# EAGLE design Final try I hope (EAGLE 9.6.2)
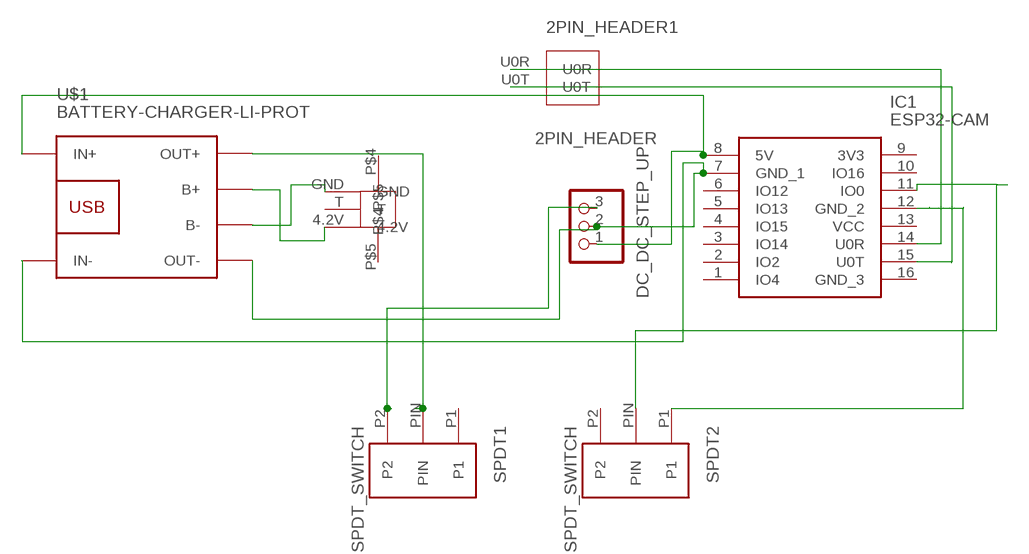
[diagram p0: schematic, sheet 1]

## Parts
2PIN_HEADER1  2PIN_HEADER  [2PIN_HEADER]
DC_DC_STEP_UP  PINHD-1X3  [1X03]
IC1  ESP32-CAM  [ESP32CAM]
SPDT1  SPDT_SWITCH  [SPDT_SWITCH]
SPDT2  SPDT_SWITCH  [SPDT_SWITCH]
U$1  BATTERY-CHARGER-LI-PROT  [BATTERY-CHARGER-LI-PROT]
U$2  BATTERY_CONNECTOR  [BATTERY_CONNECTOR]

## Nets
N$1: DC_DC_STEP_UP.1 IC1.8(5V) U$1.IN+
N$2: DC_DC_STEP_UP.3 SPDT1.P2
N$3: U$1.B- U$2.GND
N$4: U$1.B+ U$2.4.2V
N$5: IC1.11(IO0) SPDT2.PIN
N$6: IC1.12(GND_2) SPDT2.P1
N$8: 2PIN_HEADER1.U0R IC1.14(U0R)
N$9: 2PIN_HEADER1.U0T IC1.15(U0T)
N$11: SPDT1.PIN U$1.OUT+
N$12: DC_DC_STEP_UP.2 IC1.7(GND_1) U$1.IN- U$1.OUT-
Unconnected: IC1.1(IO4) IC1.2(IO2) IC1.3(IO14) IC1.4(IO15) IC1.5(IO13) IC1.6(IO12) IC1.9(3V3) IC1.10(IO16) IC1.13(VCC) IC1.16(GND_3) SPDT1.P1 SPDT2.P2 U$2.P$4 U$2.P$5 U$2.T

## Library data of the parts
2PIN_HEADER1 = 2pin_HEADER:2PIN_HEADER
DC_DC_STEP_UP = pinhead:PINHD-1X3: PIN HEADER
IC1 = ESP32-CAM:ESP32-CAM: Modules PCBA Module RoHS Source: Datasheet <https://datasheet.lcsc.com/szlcsc/Ai-Thinker-ESP32-CAM_C277946.pdf>; DESCRIPTION: Modules PCBA Module RoHS; HEIGHT: 5mm; MANUFACTURER_NAME: Ai-Thinker; MANUFACTURER_PART_NUMBER: ESP32-CAM
SPDT1 SPDT2 = SPDT_SWITCH:SPDT_SWITCH
U$1 = diy-modules:BATTERY-CHARGER-LI-PROT: Lithium Battery 5V Charger with protection circuit More details available here: http://www.instructables.com/id/DIY-Lithium-ion-Battery-Charger/step4/TP4056-based-lithium-ion-battery-charger-module/ Click here to find device on ebay.com <http://www.ebay.com/sch/tp4056+charger+usb+protection>
U$2 = Fuck:BATTERY_CONNECTOR

## Board
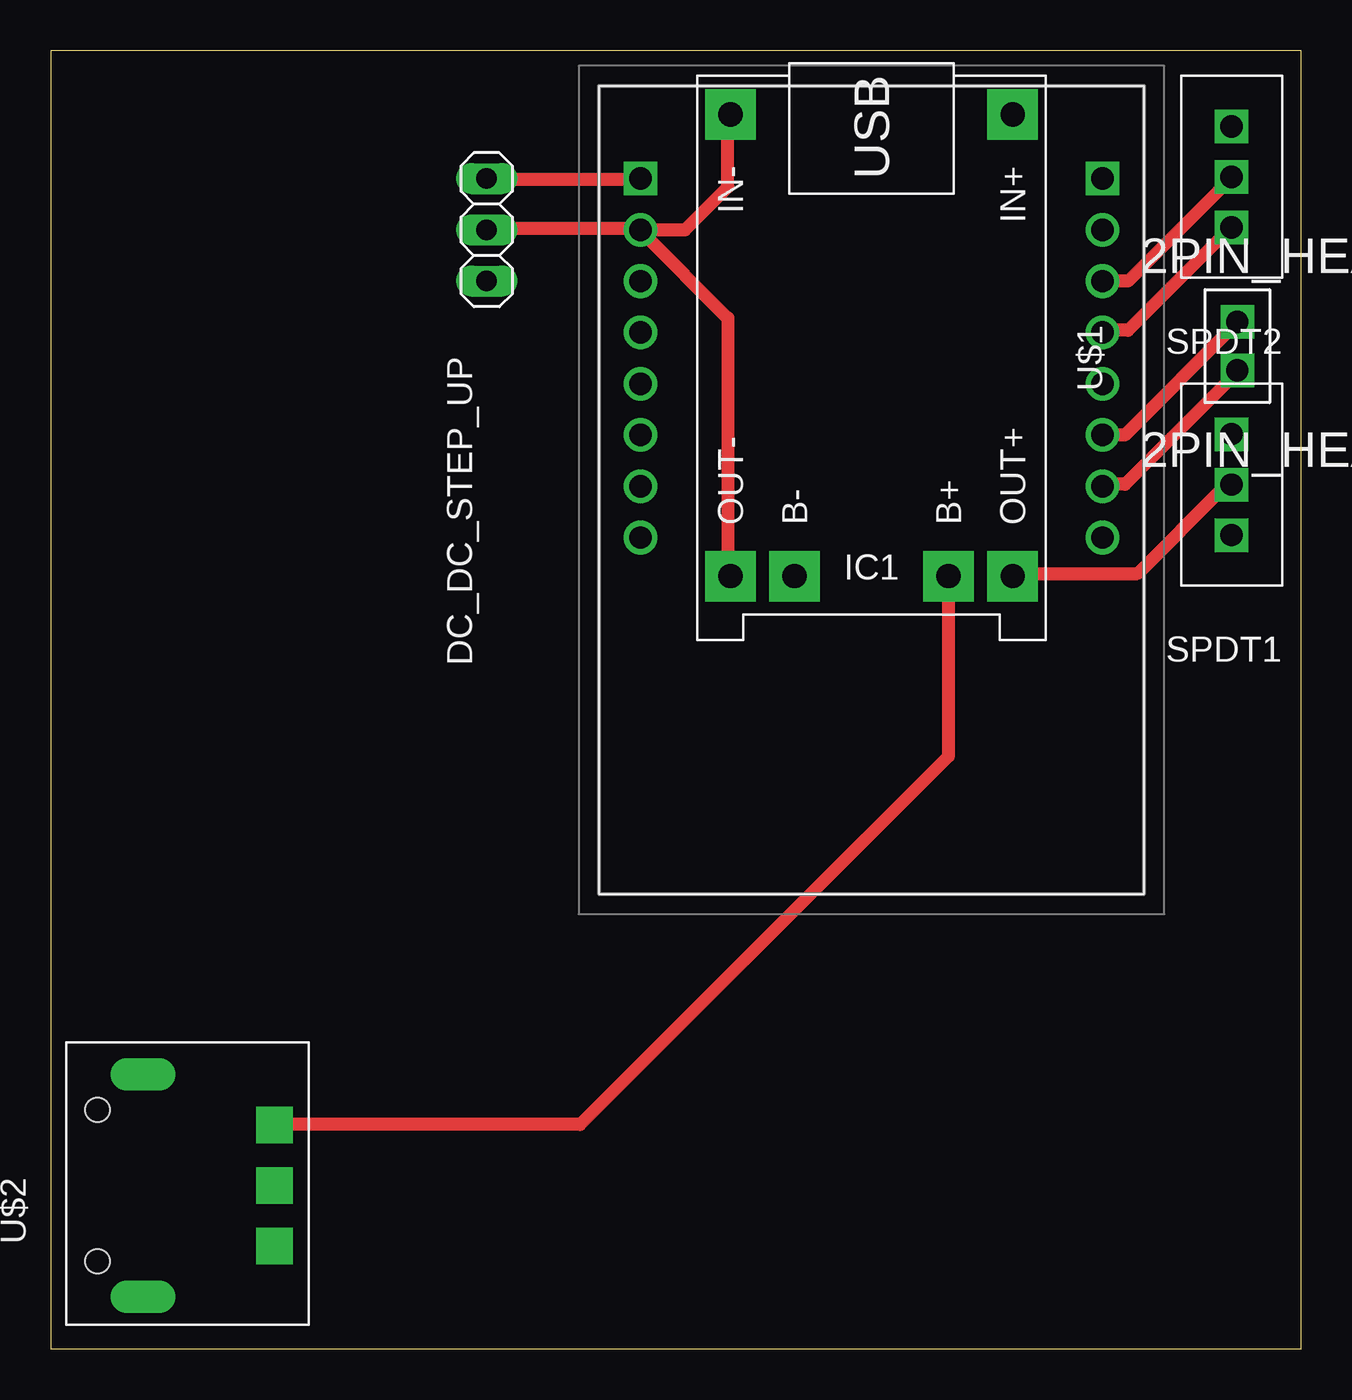
[diagram p1: board, top side]
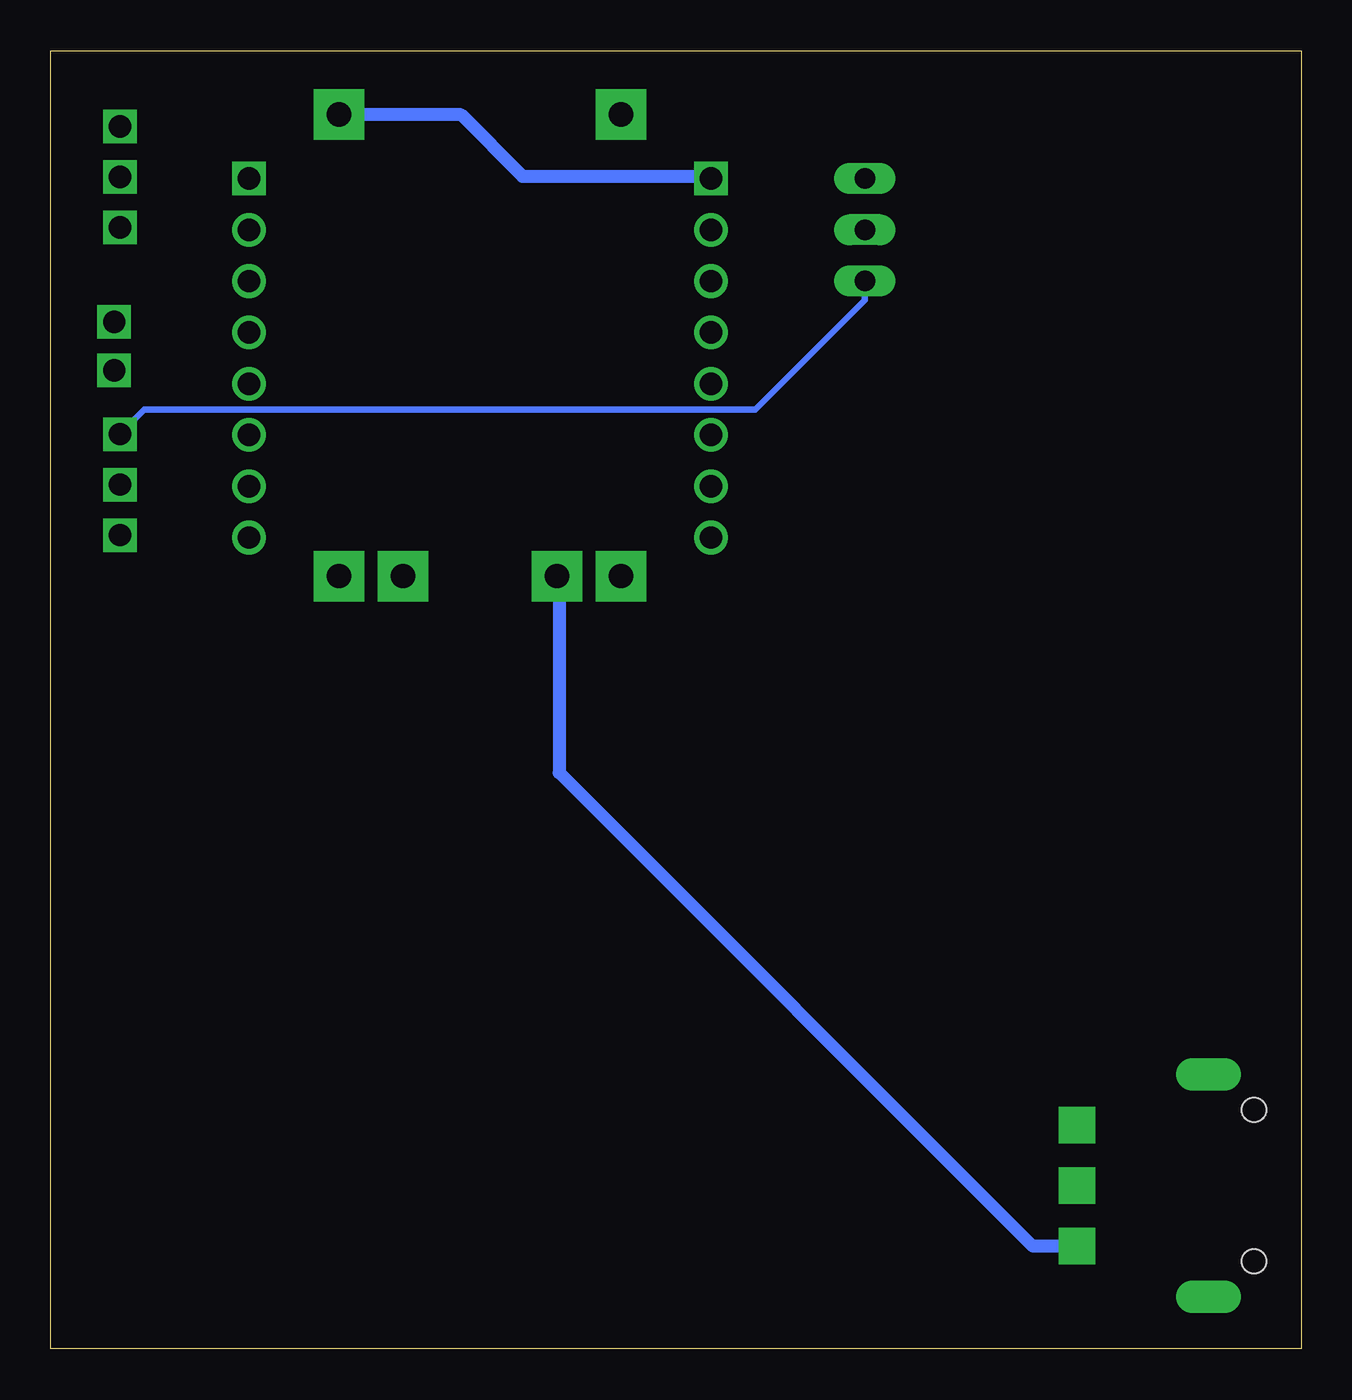
[diagram p2: board, bottom side, seen from below]

Size 61.9 x 64.3 mm. Coordinates in mm from the lower left corner, seen from the top.
Outline: 0,0 61.9,0 61.9,64.3 0,64.3 0,0
Copper layers (1*16): Top 0.035mm / dielectric 1.5mm / Bottom 0.035mm
Design rules "default": minimum track width 6mil, minimum drill 0.35mm, track to track 6mil, track to pad 6mil, pad to pad 6mil, via to via 6mil, smd to smd 6mil, copper to edge 40mil, drill to drill 6mil, minimum pad ring 10mil, minimum via ring 8mil, stop-mask expansion 4mil, vias tented up to drill 0mil, thermal gap 10mil

### Footprints (pad centres in the part's own frame; a part is rotated, then mirrored left to right if it is on the bottom)
2PIN_HEADER = drill 1.1 pad 1.665 square: U0R 1.6,5.6; U0T 1.6,3.2
1X03 = drill 1.016 long: 1 -2.54,0; 2 0,0; 3 2.54,0
ESP32CAM = drill 1.11 pad 1.665: 1 0,0; 2 0,2.54; 3 0,5.08; 4 0,7.62; 5 0,10.16; 6 0,12.7; 7 0,15.24; 10 22.86,15.24; 11 22.86,12.7; 12 22.86,10.16; 13 22.86,7.62; 14 22.86,5.08; 15 22.86,2.54; 16 22.86,0 | drill 1.11 pad 1.665 square: 8 0,17.78; 9 22.86,17.78
SPDT_SWITCH = drill 1.1 pad 1.665 square: P1 2.5,7.5; P2 2.5,2.5; PIN 2.5,5
BATTERY-CHARGER-LI-PROT = drill 1.2 pad 2.5 square: B+ 10.795,3.81; B- 10.795,-3.81; IN+ -12.065,6.985; IN- -12.065,-6.985; OUT+ 10.795,6.985; OUT- 10.795,-6.985
BATTERY_CONNECTOR = drill 0.001 pad 1.8 square: 4.2V 6.9,0.7; GND 0.9,0.7; T 3.9,0.7 | drill 0.001 pad 1.6 long: P$4 -1.6,7.2; P$5 9.4,7.2 | hole 1.2: 0.15,9.45; 7.65,9.45

### Placement (x,y rotation side)
2PIN_HEADER1  57.15,45.26 0 top
DC_DC_STEP_UP  21.59,55.42 270 top
IC1  29.21,40.18 0 top
SPDT1  60.96,47.8 180 top
SPDT2  60.96,63.04 180 top
U$1  40.64,49.07 270 top
U$2  11.78,4.19 90 top

### Tracks (layer width: path | path; a pad name or v marks a point on that pad's centre or on a via)
N$1
  Top 0.152: 21.64,57.91 DC_DC_STEP_UP.1 | 29.11,57.91 IC1.8
  Top 0.64: 29.11,57.91 21.64,57.91
  Bottom 0.152: 47.55,61.11 U$1.IN+ | 29.26,58.06 IC1.8
  Bottom 0.64: 47.55,61.11 41.58,61.11 38.53,58.06 29.26,58.06
N$2
  Bottom 0.152: 58.37,45.41 SPDT1.P2
  Bottom 0.32: DC_DC_STEP_UP.3 21.59,51.94 27.01,46.53 57.26,46.53 58.37,45.41
N$3
  Bottom 0.152: 36.73,38.25 U$1.B-
  Bottom 0.64: U$2.GND 13.27,5.09 36.73,28.54 36.73,38.25
N$4
  Top 0.152: 11.12,11.12 U$2.4.2V
  Top 0.64: 11.12,11.12 26.22,11.12 44.45,29.35 U$1.B+
N$5
  Top 0.64: IC1.11 53.34,52.88 58.37,57.91 SPDT2.PIN
N$6
  Top 0.152: 52.12,50.44 IC1.12 | 58.37,55.47 SPDT2.P1
  Top 0.64: 52.12,50.44 53.34,50.44 58.37,55.47
N$8
  Top 0.64: IC1.14 53.19,45.26 58.67,50.75 2PIN_HEADER1.U0R
N$9
  Top 0.64: IC1.15 52.12,42.82 53.19,42.82 58.67,48.31 2PIN_HEADER1.U0T
N$11
  Top 0.152: 47.7,38.4 U$1.OUT+
  Top 0.64: 47.7,38.4 53.82,38.4 58.08,42.67 58.37,42.67 SPDT1.PIN
N$12
  Top 0.152: 21.64,55.47 DC_DC_STEP_UP.2 | 29.11,55.47 IC1.7 29.26,55.32 | 33.53,38.4 U$1.OUT- | 33.53,61.11 U$1.IN-
  Top 0.64: 29.11,55.47 21.64,55.47 | 33.53,38.4 33.53,41.1 33.53,51.05 29.26,55.32 | 33.53,61.11 33.53,57.54 31.41,55.42 IC1.7